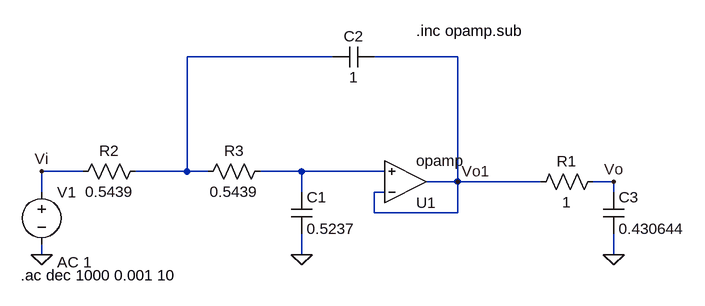
[diagram p0: schematic TS5_NORMALIZADA.asc]
TS5_NORMALIZADA.asc, the LTspice schematic file:
Version 4
SHEET 1 880 680
WIRE -192 -48 -416 -48
WIRE 0 -48 -128 -48
WIRE -576 128 -640 128
WIRE -416 128 -416 -48
WIRE -416 128 -496 128
WIRE -384 128 -416 128
WIRE -240 128 -304 128
WIRE -112 128 -240 128
WIRE 0 144 0 -48
WIRE 0 144 -48 144
WIRE 128 144 0 144
WIRE 240 144 208 144
WIRE -640 160 -640 128
WIRE -240 160 -240 128
WIRE -112 160 -128 160
WIRE 240 160 240 144
WIRE -128 192 -128 160
WIRE 0 192 0 144
WIRE 0 192 -128 192
WIRE -640 256 -640 240
WIRE -240 256 -240 224
WIRE 240 256 240 224
FLAG -240 256 0
FLAG -640 256 0
FLAG 0 144 Vo1
FLAG -640 128 Vi
FLAG 240 256 0
FLAG 240 144 Vo
SYMBOL res 224 128 R90
WINDOW 0 0 56 VBottom 2
WINDOW 3 32 56 VTop 2
SYMATTR InstName R1
SYMATTR Value 1
SYMBOL cap 224 160 R0
SYMATTR InstName C3
SYMATTR Value 0.430644
SYMBOL res -480 112 R90
WINDOW 0 0 56 VBottom 2
WINDOW 3 32 56 VTop 2
SYMATTR InstName R2
SYMATTR Value 0.5439
SYMBOL res -288 112 R90
WINDOW 0 0 56 VBottom 2
WINDOW 3 32 56 VTop 2
SYMATTR InstName R3
SYMATTR Value 0.5439
SYMBOL cap -256 160 R0
SYMATTR InstName C1
SYMATTR Value 0.5237
SYMBOL cap -128 -64 R90
WINDOW 0 0 32 VBottom 2
WINDOW 3 32 32 VTop 2
SYMATTR InstName C2
SYMATTR Value 1
SYMBOL Opamps\\opamp -80 208 M180
SYMATTR InstName U1
SYMBOL voltage -640 144 R0
WINDOW 123 24 124 Left 2
WINDOW 39 0 0 Left 2
SYMATTR Value2 AC 1
SYMATTR InstName V1
SYMATTR Value ""
TEXT -64 -88 Left 2 !.inc opamp.sub
TEXT -672 288 Left 2 !.ac dec 1000 0.001 10

The netlist it stands for:
* TS5_NORMALIZADA.asc
R1 Vo Vo1 1
C3 Vo 0 0.430644
R2 N001 Vi 0.5439
R3 N002 N001 0.5439
C1 N002 0 0.5237
C2 Vo1 N001 1
XU1 Vo1 N002 Vo1 opamp Aol=100K GBW=10Meg  ; pins invin noninvin out
V1 Vi 0 AC 1
.inc opamp.sub
.ac dec 1000 0.001 10
.backanno
.end

* Results of the author's LTspice run, read from the files saved beside the schematic
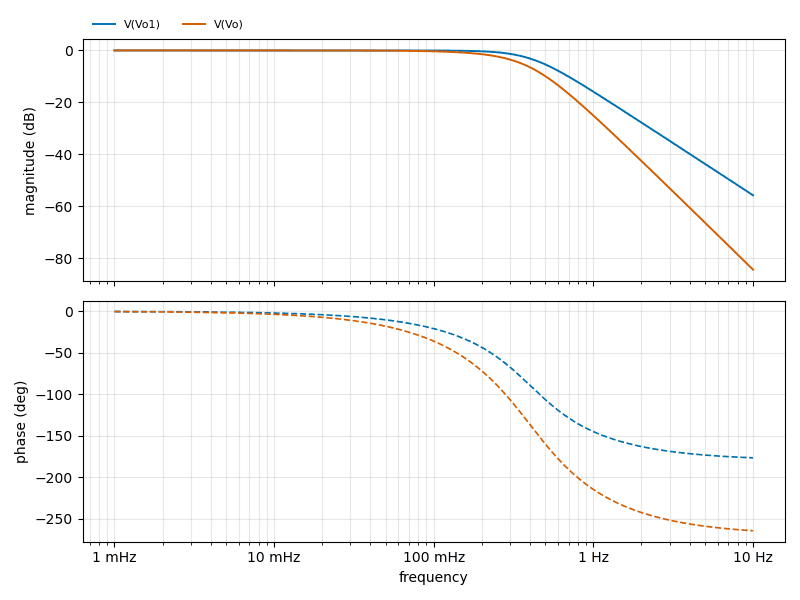
[diagram p1: AC Analysis of TS5_NORMALIZADA.asc, plotted from the saved traces]
* AC Analysis, 1 run:
*   V(Vo1): -0.00 dB at 1 mHz, -55.83 dB at 10 Hz, peak -0.00 dB at 1 mHz, 3 dB below the peak at 394.9 mHz
*   V(Vo): -0.00 dB at 1 mHz, -84.48 dB at 10 Hz, peak -0.00 dB at 1 mHz, 3 dB below the peak at 279.3 mHz